# Altium schematic sheet Main Sheet.SchDoc
size A4
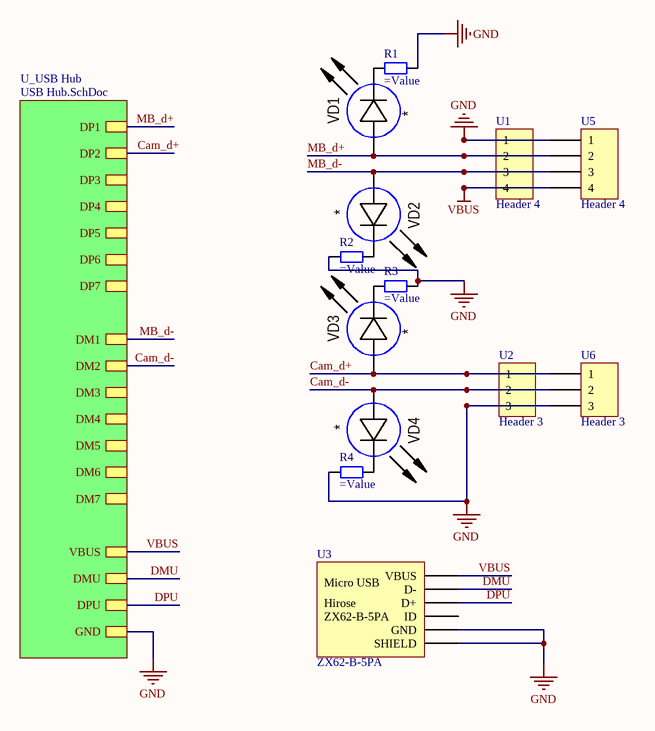
[diagram p0: Main Sheet.SchDoc]

## Parts
R1  (no value)  [res0402]
R2  (no value)  [res0402]
R3  (no value)  [res0402]
R4  (no value)  [res0402]
U1  Header 4  [4x1.25]
U2  Header 3  [3x1.25]
U3  ZX62-B-5PA  [ZX62-B-5PA]
U5  Header 4  [CON: PLS-4]
U6  Header 3  [3x2.54]
VD1  *  [CH0603LB]
VD2  *  [CH0603LB]
VD3  *  [CH0603LB]
VD4  *  [CH0603LB]

## Sub-sheets
U_USB Hub = USB Hub.SchDoc: VBUS, DMU, DPU, GND, DM1, DM2, DM3, DM4, DM5, DM6, DM7, DP1, DP2, DP3, DP4, DP5, DP6, DP7

## Nets
GND: R1.2 R2.1 R3.2 R4.1 U1.1 U2.3 U3.5(GND) U3.6(SHIELD) U5.1 U6.3 ; sheet U_USB Hub/GND
VBUS: U1.4 U3.1(VBUS) U5.4 ; sheet U_USB Hub/VBUS
Cam_d+: U2.1 U6.1 VD3.1(A) ; sheet U_USB Hub/DP2
Cam_d-: U2.2 U6.2 VD4.1(A) ; sheet U_USB Hub/DM2
DMU: U3.2(D-) ; sheet U_USB Hub/DMU
DPU: U3.3(D+) ; sheet U_USB Hub/DPU
MB_d+: U1.2 U5.2 VD1.1(A) ; sheet U_USB Hub/DP1
MB_d-: U1.3 U5.3 VD2.1(A) ; sheet U_USB Hub/DM1
NetR1_1: R1.1 VD1.2(C)
NetR2_2: R2.2 VD2.2(C)
NetR3_1: R3.1 VD3.2(C)
NetR4_2: R4.2 VD4.2(C)

Not connected (* = marked no-connect by the designer): U3 4(ID)

## Notes on the sheet
- (in symbol ZX62-B-5PA) Micro USB; Hirose

## Library data of the parts
R1-R4 = Resistor SMD
VD1-VD4 = LED: Manufacturer: *; Model: *; HelpURL: *; ComponentKind: *; Value: *